# Altium schematic sheet X_Y_Motor_Drivers.SchDoc
size A
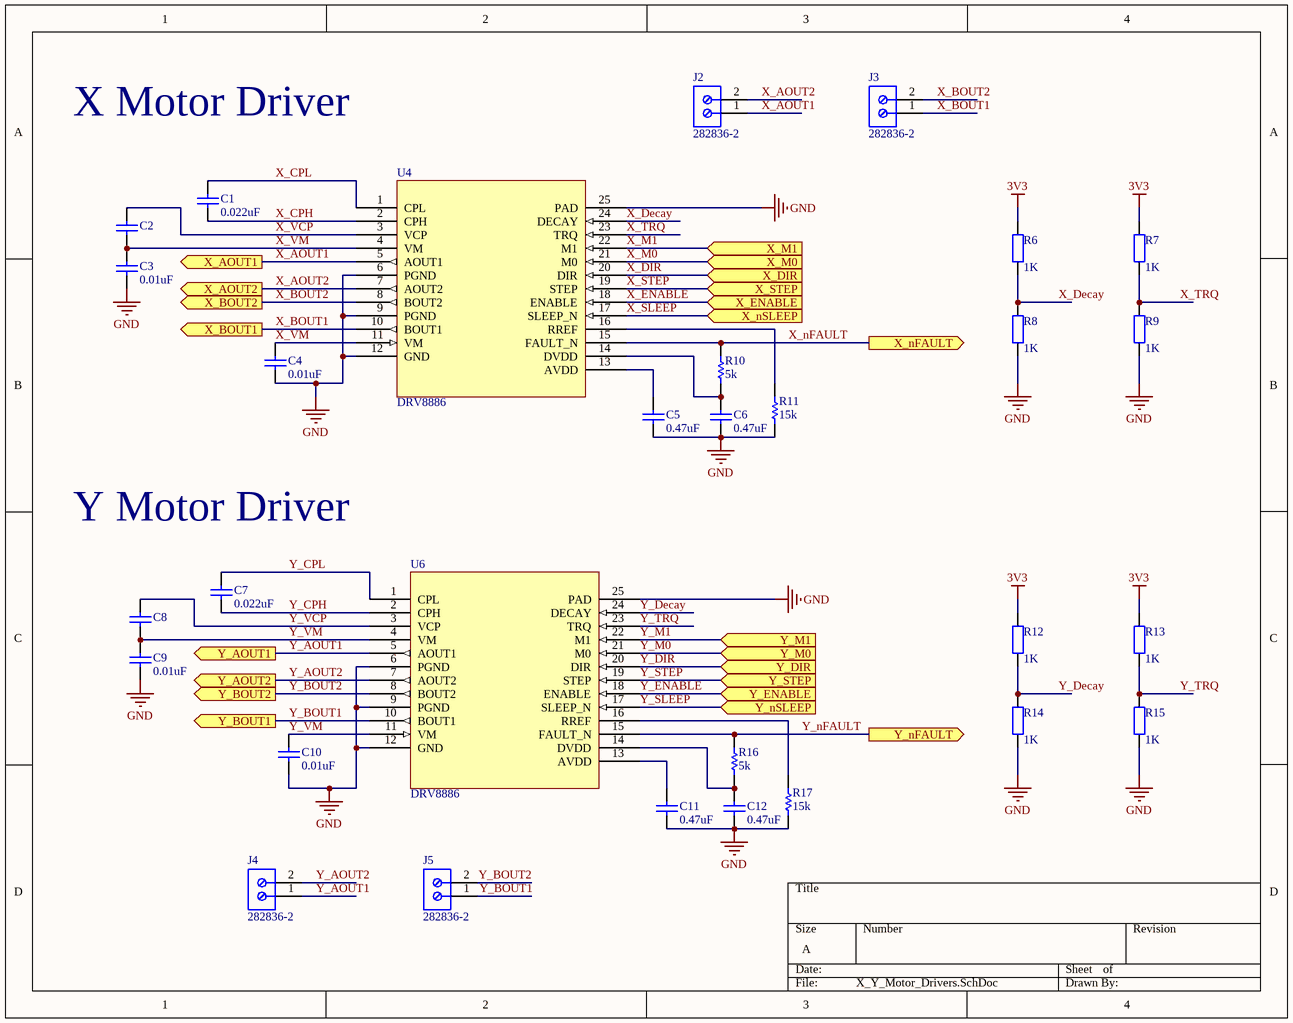
[diagram p0: X_Y_Motor_Drivers.SchDoc]

## Parts
C1  0.022uF  [CAPC1608X87X35ML15T15]
C2  0.22uF  [TDK-C1608-2_A_M]  (value not drawn)
C3  0.01uF  [CAPC1608X87X35LL15T15]
C4  0.01uF  [CAPC1608X87X35LL15T15]
C5  0.47uF  [CAPC1608X90X35ML15T15]
C6  0.47uF  [CAPC1608X90X35ML15T15]
C7  0.022uF  [CAPC1608X87X35ML15T15]
C8  0.22uF  [TDK-C1608-2_A_M]  (value not drawn)
C9  0.01uF  [CAPC1608X87X35LL15T15]
C10  0.01uF  [CAPC1608X87X35LL15T15]
C11  0.47uF  [CAPC1608X90X35ML15T15]
C12  0.47uF  [CAPC1608X90X35ML15T15]
J2  282836-2  [TECO-282836-2_V]
J3  282836-2  [TECO-282836-2_V]
J4  282836-2  [TECO-282836-2_V]
J5  282836-2  [TECO-282836-2_V]
R6  value 1K  [AXIAL-0.4]  (hidden comment: ?)
R7  value 1K  [AXIAL-0.4]  (hidden comment: ?)
R8  value 1K  [AXIAL-0.4]  (hidden comment: Res2)
R9  value 1K  [AXIAL-0.4]  (hidden comment: Res2)
R10  5k  [RESC1608X55X25ML10T15]
R11  15k  [RESC1608X55X25ML10T15]
R12  value 1K  [AXIAL-0.4]  (hidden comment: ?)
R13  value 1K  [AXIAL-0.4]  (hidden comment: ?)
R14  value 1K  [AXIAL-0.4]  (hidden comment: Res2)
R15  value 1K  [AXIAL-0.4]  (hidden comment: Res2)
R16  5k  [RESC1608X55X25ML10T15]
R17  15k  [RESC1608X55X25ML10T15]
U4  DRV8886  [PWP0024B_N]
U6  DRV8886  [PWP0024B_N]

## Ports
X_AOUT1 (out), X_AOUT2 (out), X_BOUT1 (out), X_BOUT2 (out), X_DIR (in), X_ENABLE (in), X_M0 (in), X_M1 (in), X_nFAULT (out), X_nSLEEP (in), X_STEP (in), Y_AOUT1 (out), Y_AOUT2 (out), Y_BOUT1 (out), Y_BOUT2 (out), Y_DIR (in), Y_ENABLE (in), Y_M0 (in), Y_M1 (in), Y_nFAULT (out), Y_nSLEEP (in), Y_STEP (in)

## Nets
3V3: R6.2 R7.2 R12.2 R13.2
GND: C3.2 C4.2 C5.1 C6.1 C9.2 C10.2 C11.1 C12.1 R8.1 R9.1 R11.1 R14.1 R15.1 R17.1 U4.6(PGND) U4.9(PGND) U4.12(GND) U4.25(PAD) U6.6(PGND) U6.9(PGND) U6.12(GND) U6.25(PAD)
X~{_}SLEEP: U4.17(SLEEP_N) ; port X_nSLEEP
X_AOUT1: J2.1 U4.5(AOUT1) ; port X_AOUT1
X_AOUT2: J2.2 U4.7(AOUT2) ; port X_AOUT2
X_BOUT1: J3.1 U4.10(BOUT1) ; port X_BOUT1
X_BOUT2: J3.2 U4.8(BOUT2) ; port X_BOUT2
X_CPH: C1.1 U4.2(CPH)
X_CPL: C1.2 U4.1(CPL)
X_Decay: R6.1 R8.2 U4.24(DECAY)
X_DIR: U4.20(DIR) ; port X_DIR
X_ENABLE: U4.18(ENABLE) ; port X_ENABLE
X_M0: U4.21(M0) ; port X_M0
X_M1: U4.22(M1) ; port X_M1
X_nFAULT: R10.2 U4.15(FAULT_N) ; port X_nFAULT
X_STEP: U4.19(STEP) ; port X_STEP
X_TRQ: R7.1 R9.2 U4.23(TRQ)
X_VCP: C2.2 U4.3(VCP)
X_VM: C2.1 C3.1 C4.1 U4.4(VM) U4.11(VM)
Y~{_}SLEEP: U6.17(SLEEP_N) ; port Y_nSLEEP
Y_AOUT1: J4.1 U6.5(AOUT1) ; port Y_AOUT1
Y_AOUT2: J4.2 U6.7(AOUT2) ; port Y_AOUT2
Y_BOUT1: J5.1 U6.10(BOUT1) ; port Y_BOUT1
Y_BOUT2: J5.2 U6.8(BOUT2) ; port Y_BOUT2
Y_CPH: C7.1 U6.2(CPH)
Y_CPL: C7.2 U6.1(CPL)
Y_Decay: R12.1 R14.2 U6.24(DECAY)
Y_DIR: U6.20(DIR) ; port Y_DIR
Y_ENABLE: U6.18(ENABLE) ; port Y_ENABLE
Y_M0: U6.21(M0) ; port Y_M0
Y_M1: U6.22(M1) ; port Y_M1
Y_nFAULT: R16.2 U6.15(FAULT_N) ; port Y_nFAULT
Y_STEP: U6.19(STEP) ; port Y_STEP
Y_TRQ: R13.1 R15.2 U6.23(TRQ)
Y_VCP: C8.2 U6.3(VCP)
Y_VM: C8.1 C9.1 C10.1 U6.4(VM) U6.11(VM)
NetC5_2: C5.2 U4.13(AVDD)
NetC6_2: C6.2 R10.1 U4.14(DVDD)
NetC11_2: C11.2 U6.13(AVDD)
NetC12_2: C12.2 R16.1 U6.14(DVDD)
NetR11_2: R11.2 U4.16(RREF)
NetR17_2: R17.2 U6.16(RREF)

## Notes on the sheet
- X Motor Driver
- Y Motor Driver

## Library data of the parts
C1 C7 = CMP-2006-03139-1: Part Number: C0603C223K4RACTU; Manufacturer: Kemet
C2 C8 = CMP-2000-05394-1: Cap Ceramic, 0.22 uF, +/- 10%, -55 to 125 degC, 2-Pin SMD (0603), RoHS, Tape and Reel; Manufacturer: TDK; PCN Part Number: MLCCPartNumberChange30/Nov/2012; Capacitance: 0.22µF; Other Names: 445-7408-1; Design Resources: 20WNon-IsolatedBuckLEDDriverUsingPLLNK460KG; Online Catalog: CSeries,GeneralPurpose; Kits: 445-9014-KIT-ND-KITMLCC100PF-22UF060310-50V445-9003-KIT-ND-KITCAPCERHICAPMLCCSMD445-173086-KIT-ND-C0402-2220X7R6.3-50V1,000PF-; Temperature Coefficient: X7R; Product Training Modules: CSeriesGeneralApplicationsSEAT,CCV,andTVCLDesignToolsGuidetoReplacinganElectrolyticCapacitorwithanMLCC; Voltage - Rated: 50V; Ratings: -; Lead Spacing: -; Package Description: 2-Pin Chip Capacitor, Body 1.7 x 0.9 mm; Datasheet URL: https://datasheet.ciiva.com/24218/c1608x7r1h224k080ab-264841-24218813.pdf; Applications: GeneralPurpose; Series: C; Manufacturer URL: http://www.tdk.com/; Size / Dimension: 0.063"Lx0.031"W(1.60mmx0.80mm); Features: -; Tolerance: ±10%; Package Reference: 603; Family: CeramicCapacitors; Standard Package: 1; RoHS Information: RoHSCertificate-MLCC; Thickness (Max): 0.035"(0.90mm); Package / Case: 0603(1608Metric); Operating Temperature: -55degC~125degC; Datasheet Version: Sep-13; Mounting Type: SurfaceMount,MLCC; Lead Style: -; Height - Seated (Max): -; Packaging: CutTape(CT); Category: Capacitors
C3 C4 C9 C10 = CMP-2006-03299-1: Manufacturer: Kemet; Part Number: C0603X103K5RACTU
C5 C6 C11 C12 = CMP-2006-04187-1: Part Number: 06033C474KAT2A; Manufacturer: AVX Interconnect / Elco
J2-J5 = CMP-1684-00017-1: Female Header, Pitch 5 mm, 1 x 2 Position, Height 10 mm, Tail Length 3.5 mm, Rohs, Bulk; Manufacturer: TE Connectivity; Wire Gauge: 16-30AWG; Product Training Modules: Wire-to-BoardEurostyleTerminalBlocks; Clamp Material - Plating: Brass-NickelPlated; Voltage: 300V; Mating Orientation: HorizontalwithBoard; Current: 13.5A; Pitch: 0.197"(5.00mm); Screw Thread: M3; 3D Model: 282836-2.pdf; Other Names: 5ULV-02B / A98076; Dynamic Catalog: BuchananSeries; Number of Levels: 1; Torque - Screw: 0.68Nm(6Lb-In); Featured Product: EurostyleTerminalBlockConnectors; Positions Per Level: 2; Wire Termination: Screw-RisingCageClamp; Datasheet URL: http://www.te.com.cn/commerce/DocumentDelivery/DDEController?Action=showdoc&DocId=Catalog+Section%7F1308389_EUROSTYLE_TERMINAL_BLOCKS%7F0607%7Fpdf%7FEnglish%7FENG_CS_1308389_EUROSTYLE_TERMINAL_BLOCKS_0607.pdf%7F282836-2; Color: Green; Family: TerminalBlocks-WiretoBoard; RoHS Information: 282836-2StatementofCompliance; Standard Package: 300; Contact Material - Plating: Brass-TinPlated; Manufacturer URL: http://www.te.com; Housing Material: Polyamide(PA66),Nylon6/6; Features: Interlocking(Side); Package Description: Female Header, Pitch 5 mm, 1 x 2 Position, Height 10 mm, Tail Length 3.5 mm; Mounting Type: ThroughHole; Package Reference: THD; Packaging: Bulk; Series: Buchanan; Category: Connectors,Interconnects; Screw Material - Plating: Brass-NickelPlated
R6-R9 R12-R15 = Res2: Resistor; Published: 8-Jun-2000; LatestRevisionDate: 17-Jul-2002; LatestRevisionNote: Re-released for DXP Platform.; PackageReference: AXIAL-0.4; Publisher: Altium Limited; PackageDescription: Axial Device, Thru-Hole; 2 Leads; 0.4 in Pin Spacing
R10 R11 R16 R17 = CMP-2100-03667-1: Chip Resistor, 0 Ohm, +/- 5%, 0.1 W, -55 to 155 degC, 0603 (1608 Metric), RoHS, Tape and Reel; Manufacturer: Yageo; Temperature Coefficient: 200ppm/degreesC; Voltage Rating: 50V; Power Rating: 100mW; Resistance: 0mOhm; Width: 0.8mm; Max Operating Temperature: 155degC; Tolerance: 5%; Package Reference: 0603; Height: 0.45mm; Depth: 0.8mm; Package Description: 2-Pin Surface Mount Device, Body 1.6 x 0.8 mm; Termination: SMD/SMT; Package Quantity: 5000; Case/Package: 0603; Case Code (Imperial): 0603; Radiation Hardening: No; Number of Pins: 2; Length: 1.6mm; Lead Free: LeadFree; Voltage Rating (DC): 50V; Military Standard: Not; Datasheet URL: http://www.yageo.com/NewPortal/yageodocoutput?fileName=/pdf/R-Chip/PYu-RC_Group_51_RoHS_L_5.pdf; Manufacturer URL: http://www.yageo.com/; Packaging: TapeandReel; Case Code (Metric): 1608; Min Operating Temperature: -55degC; Composition: ThickFilm; RoHSCompliant: true; Contact Plating: Tin; Datasheet Version: Rev. 5, 10/2016; REACH SVHC: NoSVHC